# EAGLE design Musicbox (EAGLE 8.6.3)
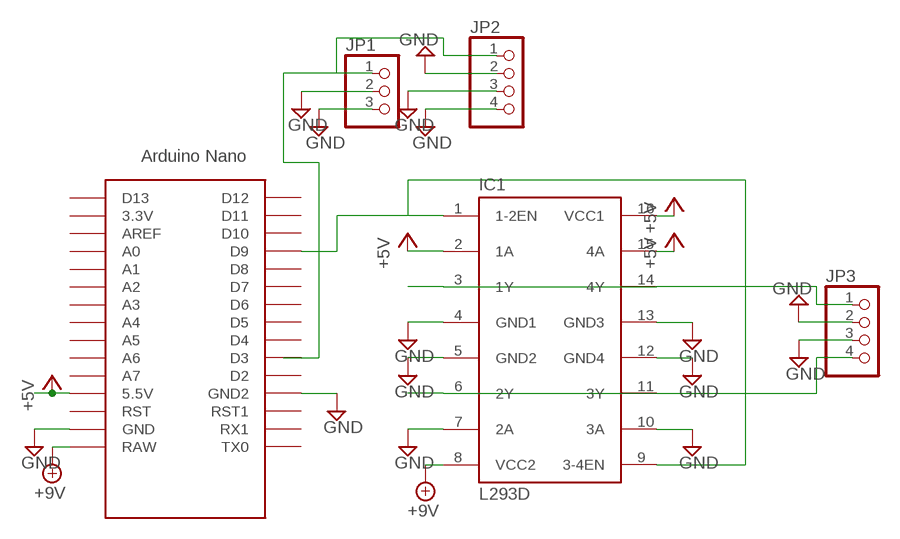
[diagram p0: schematic, sheet 1]

## Parts
IC1  L293D  [DIL16]
JP1  PINHD-1X3  [1X03]
JP2  PINHD-1X4  [1X04]
JP3  PINHD-1X4  [1X04]
U$1  NANO  [NANO]

## Nets
3Y: IC1.6(2Y) IC1.11(3Y) JP3.4
4Y: IC1.3(1Y) IC1.14(4Y) JP3.1
+5V: IC1.2(1A) IC1.15(4A) IC1.16(VCC1) U$1.5V(5.5V)
+9V [+9V]: IC1.8(VCC2) U$1.RAW
BUZZER: JP1.1 JP2.1 U$1.D3
EN: IC1.1(1-2EN) IC1.9(3-4EN) U$1.D9
GND: IC1.4(GND1) IC1.5(GND2) IC1.7(2A) IC1.10(3A) IC1.12(GND4) IC1.13(GND3) JP1.2 JP1.3 JP2.2 JP2.3 JP2.4 JP3.2 JP3.3 U$1.GND U$1.GND1(GND2)
Unconnected: U$1.3.3V U$1.A0 U$1.A1 U$1.A2 U$1.A3 U$1.A4 U$1.A5 U$1.A6 U$1.A7 U$1.AREF U$1.D2 U$1.D4 U$1.D5 U$1.D6 U$1.D7 U$1.D8 U$1.D10 U$1.D11 U$1.D12 U$1.D13 U$1.ICSP1 U$1.ICSP2 U$1.ICSP3 U$1.ICSP4 U$1.ICSP5 U$1.ICSP6 U$1.RST U$1.RST1 U$1.RX1 U$1.TX0

## Library data of the parts
IC1 = st-microelectronics:L293D: PUSH-PULL 4 CHANNEL DRIVER; MPN: L293D; OC_FARNELL: 9589619; OC_NEWARK: 56P8249
JP1 = pinhead:PINHD-1X3: PIN HEADER
JP2 JP3 = pinhead:PINHD-1X4: PIN HEADER
U$1 = Arduino-clone:NANO: Arduino Nano

## Net classes
0 default: width 1 mm, drill 1.016 mm, clearance 0.5 mm
1 +9V: width 1.5 mm, drill 1.143 mm, clearance 0.75 mm to class 0, clearance 0.75 mm

## Board
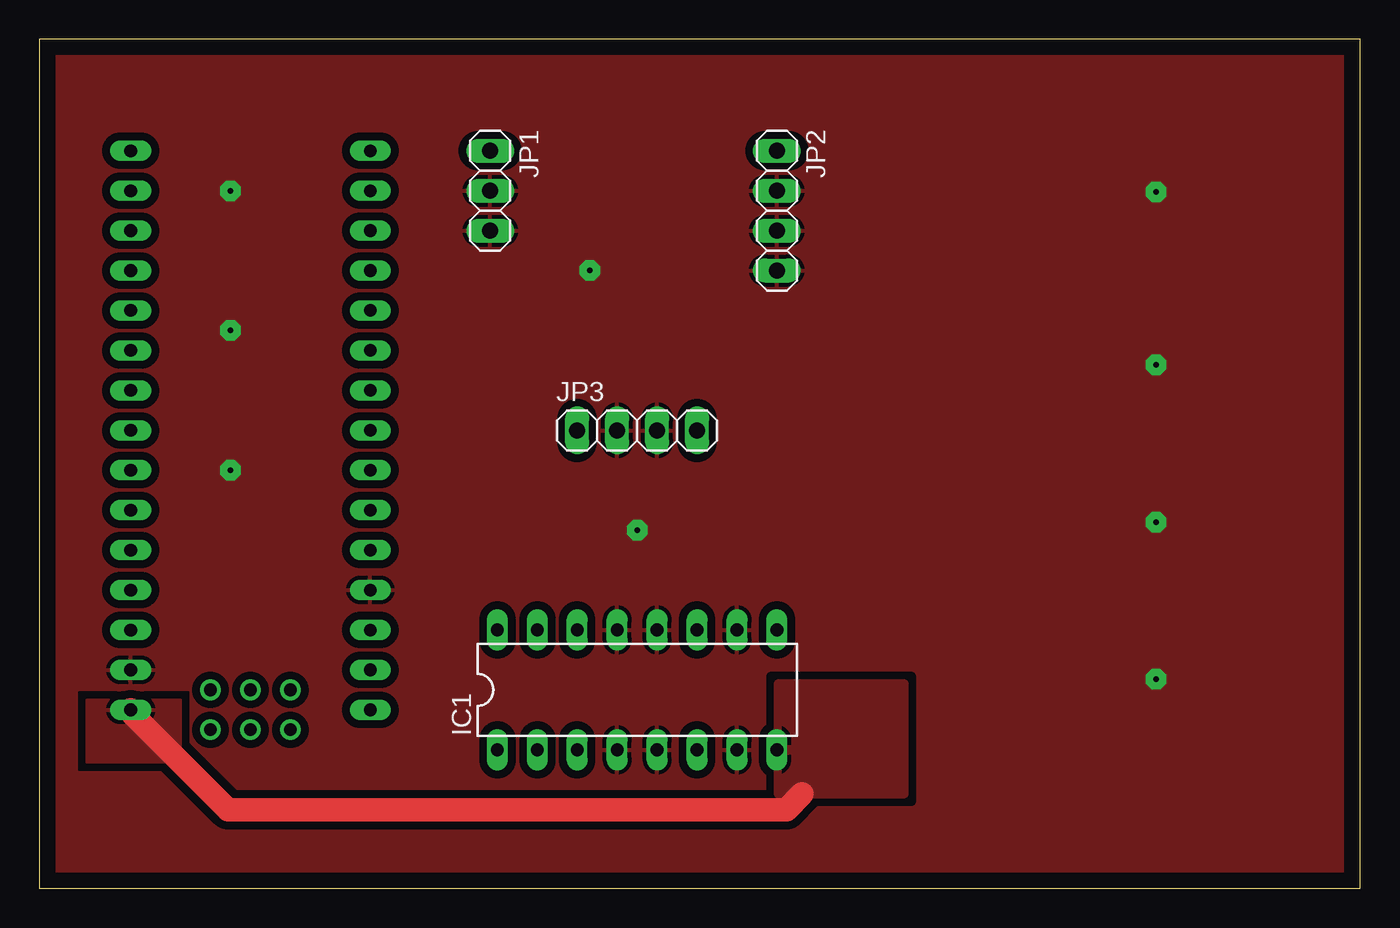
[diagram p1: board, top side]
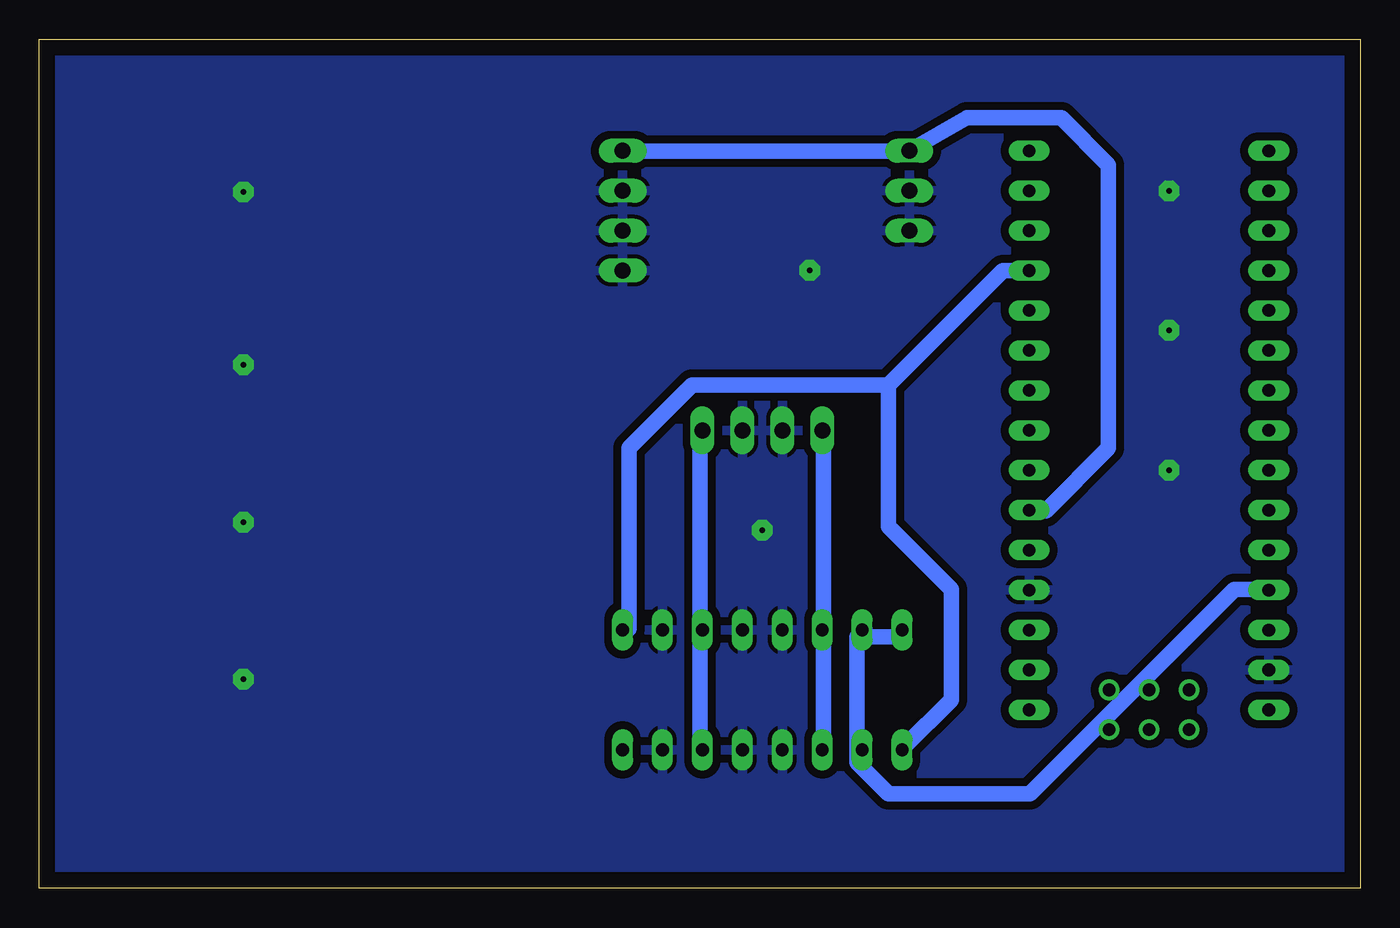
[diagram p2: board, bottom side, seen from below]

Size 84 x 54 mm. Coordinates in mm from the lower left corner, seen from the top.
Outline: 84,0 84,54 0,54 0,0 84,0
Copper layers (1*16): Top 0.035mm / dielectric 1.5mm / Bottom 0.035mm
Design rules "default": minimum track width 6mil, minimum drill 0.35mm, track to track 6mil, track to pad 6mil, pad to pad 6mil, via to via 6mil, smd to smd 6mil, copper to edge 40mil, drill to drill 6mil, minimum pad ring 10mil, minimum via ring 8mil, stop-mask expansion 4mil, vias tented up to drill 0mil, thermal gap 10mil

### Footprints (pad centres in the part's own frame; a part is rotated, then mirrored left to right if it is on the bottom)
DIL16 = drill 0.813 long: 1 -8.89,-3.81; 2 -6.35,-3.81; 3 -3.81,-3.81; 4 -1.27,-3.81; 5 1.27,-3.81; 6 3.81,-3.81; 7 6.35,-3.81; 8 8.89,-3.81; 9 8.89,3.81; 10 6.35,3.81; 11 3.81,3.81; 12 1.27,3.81; 13 -1.27,3.81; 14 -3.81,3.81; 15 -6.35,3.81; 16 -8.89,3.81
1X03 = drill 1.016 long: 1 -2.54,0; 2 0,0; 3 2.54,0
1X04 = drill 1.016 long: 1 -3.81,0; 2 -1.27,0; 3 1.27,0; 4 3.81,0
NANO = drill 0.8 long: 3.3V -10.16,24.13; 5V -10.16,-1.27; A0 -10.16,19.05; A1 -10.16,16.51; A2 -10.16,13.97; A3 -10.16,11.43; A4 -10.16,8.89; A5 -10.16,6.35; A6 -10.16,3.81; A7 -10.16,1.27; AREF -10.16,21.59; D2 5.08,1.27; D3 5.08,3.81; D4 5.08,6.35; D5 5.08,8.89; D6 5.08,11.43; D7 5.08,13.97; D8 5.08,16.51; D9 5.08,19.05; D10 5.08,21.59; D11 5.08,24.13; D12 5.08,26.67; D13 -10.16,26.67; GND -10.16,-6.35; GND1 5.08,-1.27; RAW -10.16,-8.89; RST -10.16,-3.81; RST1 5.08,-3.81; RX1 5.08,-6.35; TX0 5.08,-8.89 | drill 0.8: ICSP1 -5.08,-10.16; ICSP2 -5.08,-7.62; ICSP3 -2.54,-10.16; ICSP4 -2.54,-7.62; ICSP5 0,-10.16; ICSP6 0,-7.62

### Placement (x,y rotation side)
IC1  38.02,12.62 0 top
JP1  28.67,44.37 270 top
JP2  46.91,43.1 270 top
JP3  38.02,29.13 0 top
U$1  15.97,20.24 0 top

### Tracks (layer width: path | path; a pad name or v marks a point on that pad's centre or on a via)
3Y
  Bottom 1: IC1.6 42,9 42,16.12 IC1.11 42,16.88 42,28.88 JP3.4
4Y
  Bottom 1: IC1.3 34.12,9 34.12,16.12 IC1.14 34.12,16.88 34.12,28.88 JP3.1
+5V
  Bottom 1: 29.25,16.5 IC1.16 29.25,16.12 29.25,16 | 31.5,16.5 IC1.15 31.88,16.12 32,16 | 32,9 32,8 30,6 21,6 8,19 6,19 6,19.12 U$1.5V | 32,9 32,16 | 32,16 29.25,16 | 29.25,16 29,16 | 32,9 31.88,9 IC1.2
+9V
  Top 1.5: 48.5,6 47.5,5 12,5 6,11 U$1.RAW
  pour Top: 47,6 47,13 55,13 55,6
  pour Top: 9,12 3,12 3,8 9,8
BUZZER
  Bottom 1: JP2.1 46.88,46.88 28.88,46.88 JP1.1 25,49 19,49 16,46 16,28 20,24 U$1.D3
EN
  Bottom 1: IC1.1 29,9 26,12 26,19 30,23 30,32 | 30,32 42.5,32 46.5,28 46.5,16.5 IC1.9 | U$1.D9 22.71,39.29 30,32
GND  (via drill 0.35 pad 1.3)
  Bottom 0.61: IC1.10
  other vias: 38.02,22.78 35.02,39.29 12.16,35.48 12.16,44.37 12.16,26.59 71.02,44.29 71.02,33.29 71.02,23.29 71.02,13.29
  pour Top (rank 6): 0,54 0,0 84,0 84,54
  pour Bottom: 0,0 84,0 84,54 0,54